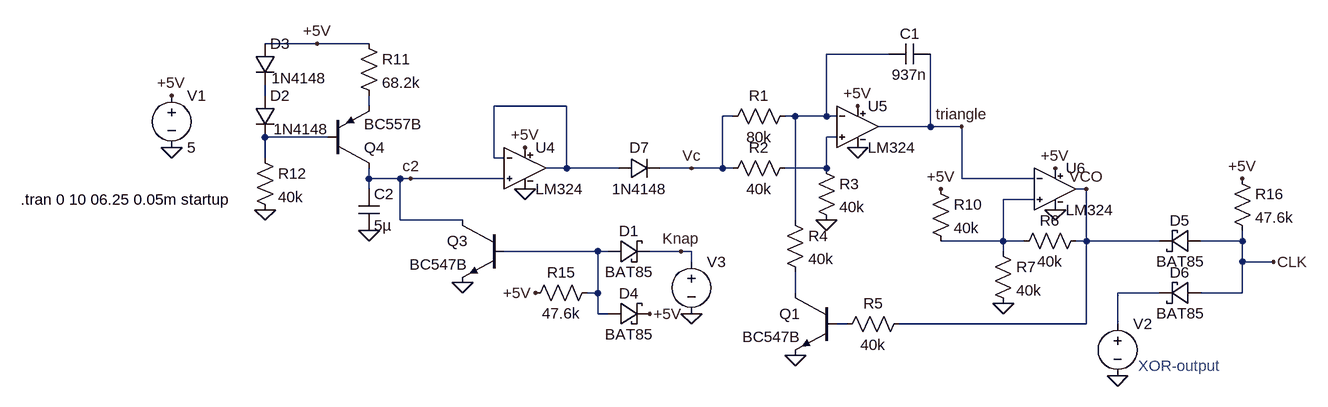
[diagram p0: schematic osc.asc]
osc.asc, the LTspice schematic file:
Version 4
SHEET 1 1748 680
WIRE -832 16 -912 16
WIRE -752 16 -832 16
WIRE 48 32 -48 32
WIRE -912 96 -912 80
WIRE -752 112 -752 96
WIRE -448 112 -560 112
WIRE -192 128 -208 128
WIRE -96 128 -112 128
WIRE -48 128 -48 32
WIRE -48 128 -96 128
WIRE -32 128 -48 128
WIRE 112 144 112 32
WIRE 112 144 32 144
WIRE 160 144 112 144
WIRE -816 160 -912 160
WIRE -32 160 -48 160
WIRE -912 192 -912 160
WIRE -560 192 -560 112
WIRE -544 192 -560 192
WIRE -448 208 -448 112
WIRE -448 208 -480 208
WIRE -368 208 -448 208
WIRE -256 208 -304 208
WIRE -208 208 -208 128
WIRE -208 208 -256 208
WIRE -192 208 -208 208
WIRE -48 208 -48 160
WIRE -48 208 -112 208
WIRE -752 224 -752 208
WIRE -704 224 -752 224
WIRE -688 224 -704 224
WIRE -544 224 -688 224
WIRE 160 224 160 144
WIRE 272 224 160 224
WIRE -752 240 -752 224
WIRE 352 240 336 240
WIRE 272 256 224 256
WIRE -704 288 -704 224
WIRE -608 288 -704 288
WIRE -96 288 -96 128
WIRE 224 320 224 256
WIRE 224 320 128 320
WIRE 256 320 224 320
WIRE 352 320 352 240
WIRE 352 320 336 320
WIRE 464 320 352 320
WIRE 592 320 592 304
WIRE 592 320 528 320
WIRE -400 336 -544 336
WIRE -384 336 -400 336
WIRE -272 336 -320 336
WIRE -256 336 -272 336
WIRE 224 336 224 320
WIRE -256 352 -256 336
WIRE 592 352 592 320
WIRE 640 352 592 352
WIRE -400 400 -400 336
WIRE -400 400 -416 400
WIRE -96 400 -96 368
WIRE 464 400 400 400
WIRE 592 400 592 352
WIRE 592 400 528 400
WIRE -400 432 -400 400
WIRE -384 432 -400 432
WIRE -16 448 -32 448
WIRE 352 448 352 320
WIRE 352 448 64 448
WIRE 400 448 400 400
FLAG -1056 96 +5V
FLAG 0 112 +5V
FLAG 304 208 +5V
FLAG -48 288 0
FLAG -96 496 0
FLAG 224 416 0
FLAG -752 304 0
FLAG -608 384 0
FLAG -512 176 +5V
FLAG 0 176 0
FLAG 304 272 0
FLAG 128 240 +5V
FLAG -832 16 +5V
FLAG -912 272 0
FLAG -496 400 +5V
FLAG -320 432 +5V
FLAG 592 224 +5V
FLAG 352 240 VCO
FLAG 400 528 0
FLAG -1056 176 0
FLAG -512 240 0
FLAG -256 432 0
FLAG 640 352 CLK
FLAG -272 336 Knap
FLAG -256 208 Vc
FLAG 160 144 triangle
FLAG -688 224 c2
SYMBOL voltage -1056 80 R0
WINDOW 123 0 0 Left 0
WINDOW 39 0 0 Left 0
SYMATTR InstName V1
SYMATTR Value 5
SYMBOL cap 112 16 R90
WINDOW 0 0 32 VBottom 0
WINDOW 3 32 32 VTop 0
SYMATTR InstName C1
SYMATTR Value 937n
SYMBOL res -208 144 R270
WINDOW 0 32 56 VTop 0
WINDOW 3 0 56 VBottom 0
SYMATTR InstName R1
SYMATTR Value 80k
SYMBOL res -208 224 R270
WINDOW 0 32 56 VTop 0
WINDOW 3 0 56 VBottom 0
SYMATTR InstName R2
SYMATTR Value 40k
SYMBOL res -64 192 R0
SYMATTR InstName R3
SYMATTR Value 40k
SYMBOL res -112 272 R0
SYMATTR InstName R4
SYMATTR Value 40k
SYMBOL npn -32 400 M0
SYMATTR InstName Q1
SYMATTR Value BC547B
SYMBOL res 80 432 R90
WINDOW 0 0 56 VBottom 0
WINDOW 3 32 56 VTop 0
SYMATTR InstName R5
SYMATTR Value 40k
SYMBOL res 352 304 R90
WINDOW 0 0 56 VBottom 0
WINDOW 3 32 56 VTop 0
SYMATTR InstName R6
SYMATTR Value 40k
SYMBOL res 208 320 R0
SYMATTR InstName R7
SYMATTR Value 40k
SYMBOL cap -768 240 R0
SYMATTR InstName C2
SYMATTR Value 5µ
SYMBOL npn -544 288 M0
SYMATTR InstName Q3
SYMATTR Value BC547B
SYMBOL res 112 224 R0
SYMATTR InstName R10
SYMATTR Value 40k
SYMBOL pnp -816 208 M180
SYMATTR InstName Q4
SYMATTR Value BC557B
SYMBOL diode -928 96 R0
WINDOW 3 29 52 Left 0
SYMATTR Value 1N4148
SYMATTR InstName D2
SYMBOL diode -928 16 R0
WINDOW 3 26 53 Left 0
SYMATTR Value 1N4148
SYMATTR InstName D3
SYMBOL res -768 0 R0
SYMATTR InstName R11
SYMATTR Value 68.2k
SYMBOL res -928 176 R0
SYMATTR InstName R12
SYMATTR Value 40k
SYMBOL res -400 384 R90
WINDOW 0 0 56 VBottom 0
WINDOW 3 32 56 VTop 0
SYMATTR InstName R15
SYMATTR Value 47.6k
SYMBOL res 576 208 R0
SYMATTR InstName R16
SYMATTR Value 47.6k
SYMBOL myLib\\LM324 -512 144 R0
SYMATTR InstName U4
SYMBOL myLib\\LM324 0 80 R0
SYMATTR InstName U5
SYMBOL myLib\\LM324 304 176 R0
SYMATTR InstName U6
SYMBOL voltage 400 432 R0
WINDOW 3 24 104 Invisible 0
WINDOW 123 0 0 Left 0
WINDOW 39 0 0 Left 0
SYMATTR Value PWL file=v2.txt
SYMATTR InstName V2
SYMBOL voltage -256 336 R0
WINDOW 3 24 104 Invisible 0
WINDOW 123 0 0 Left 0
WINDOW 39 0 0 Left 0
SYMATTR Value PWL file=v3.txt
SYMATTR InstName V3
SYMBOL myLib\\BAT85 -384 352 R270
WINDOW 0 32 32 VTop 0
WINDOW 3 0 32 VBottom 0
SYMATTR InstName D1
SYMBOL myLib\\BAT85 -384 448 R270
WINDOW 0 32 32 VTop 0
WINDOW 3 0 32 VBottom 0
SYMATTR InstName D4
SYMBOL myLib\\BAT85 528 304 R90
WINDOW 0 0 32 VBottom 0
WINDOW 3 32 32 VTop 0
SYMATTR InstName D5
SYMBOL myLib\\BAT85 528 384 R90
WINDOW 0 0 32 VBottom 0
WINDOW 3 32 32 VTop 0
SYMATTR InstName D6
SYMBOL diode -368 224 R270
WINDOW 0 32 32 VTop 0
WINDOW 3 0 32 VBottom 0
SYMATTR InstName D7
SYMATTR Value 1N4148
TEXT -1288 256 Left 0 !.tran 0 10 06.25 0.05m startup
TEXT 432 512 Left 0 ;XOR-output

The netlist it stands for:
* osc.asc
V1 +5V 0 5
C1 triangle N001 937n
R1 Vc N001 80k
R2 Vc N006 40k
R3 N006 0 40k
R4 N001 N009 40k
Q1 N009 N011 0 0 BC547B
R5 VCO N011 40k
R6 VCO N007 40k
R7 N007 0 40k
C2 c2 0 5µ
Q3 c2 N008 0 0 BC547B
R10 +5V N007 40k
Q4 c2 N005 N003 0 BC557B
D2 N002 N005 1N4148
D3 +5V N002 1N4148
R11 +5V N003 68.2k
R12 N005 0 40k
R15 N008 +5V 47.6k
R16 +5V CLK 47.6k
XU4 c2 N004 +5V 0 N004 LM324  ; pins In+ In- V+ V- OUT
XU5 N006 N001 +5V 0 triangle LM324  ; pins In+ In- V+ V- OUT
XU6 N007 triangle +5V 0 VCO LM324  ; pins In+ In- V+ V- OUT
V2 N010 0 PWL file=v2.txt
V3 Knap 0 PWL file=v3.txt
XD1 N008 Knap BAT85  ; pins + -
XD4 N008 +5V BAT85  ; pins + -
XD5 CLK VCO BAT85  ; pins + -
XD6 CLK N010 BAT85  ; pins + -
D7 N004 Vc 1N4148
.model D D
.lib standard.dio
.model NPN NPN
.model PNP PNP
.lib standard.bjt
.tran 0 10 06.25 0.05m startup
* XOR-output
.lib myLib\LM324.lib
.lib myLib\BAT85.lib
.backanno
.end